# EAGLE schematic Footprint (EAGLE 5.10)
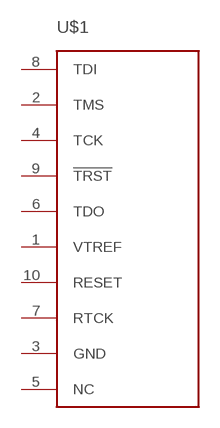
[diagram p0: schematic, sheet 1]

## Parts
U$1  TC2050-MCP-NL  [TC2030-MCP-NL]
Unconnected: U$1.1(VTREF) U$1.2(TMS) U$1.3(GND) U$1.4(TCK) U$1.5(NC) U$1.6(TDO) U$1.7(RTCK) U$1.8(TDI) U$1.9(!TRST) U$1.10(RESET)

## Library data of the parts
U$1 = TC2050:TC2050: TAG-CONNECT ISP Connector Manufacturer: Tag-Connect <www.tag-connect.com> Cable for easy In-Circuit PCB Programming. Designed for JTAG 10 pin, suitable for many others. Pin Connection for TC2050 NL. PAD Description 1 VTREF 2 TMS 3 GND 4 TCK 5 NC 6 TDO 7 RTCK 8 TDI 9 !TRST 10 RESET ©2009 ROFA.cz Modified 7/2011 by Tim McCarthy-Smith VIDA Products INC